# EAGLE design PalAdapter (EAGLE 7.4.0)
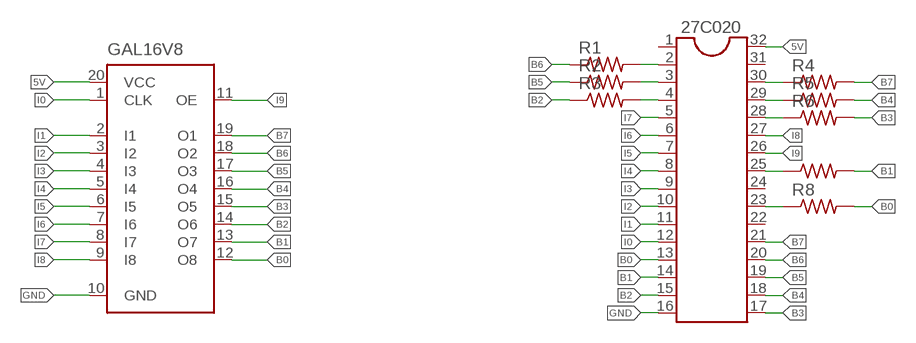
[diagram p0: schematic, sheet 1]

## Parts
27C020  DIL32  [DIL32]
GAL16V8  ATF16V8BP3  [DIL20]
R1  R-US_0204/7  [0204/7]
R2  R-US_0204/7  [0204/7]
R3  R-US_0204/7  [0204/7]
R4  R-US_0204/7  [0204/7]
R5  R-US_0204/7  [0204/7]
R6  R-US_0204/7  [0204/7]
R7  R-US_0204/7  [0204/7]
R8  R-US_0204/7  [0204/7]

## Nets
5V: 27C020.32 GAL16V8.20(VCC)
B0: 27C020.13 GAL16V8.12(O8) R8.2
B1: 27C020.14 GAL16V8.13(O7) R7.2
B2: 27C020.15 GAL16V8.14(O6) R3.1
B3: 27C020.17 GAL16V8.15(O5) R6.2
B4: 27C020.18 GAL16V8.16(O4) R5.2
B5: 27C020.19 GAL16V8.17(O3) R2.1
B6: 27C020.20 GAL16V8.18(O2) R1.1
B7: 27C020.21 GAL16V8.19(O1) R4.2
GND: 27C020.16 GAL16V8.10(GND)
I0: 27C020.12 GAL16V8.1(CLK)
I1: 27C020.11 GAL16V8.2(I1)
I2: 27C020.10 GAL16V8.3(I2)
I3: 27C020.9 GAL16V8.4(I3)
I4: 27C020.8 GAL16V8.5(I4)
I5: 27C020.7 GAL16V8.6(I5)
I6: 27C020.6 GAL16V8.7(I6)
I7: 27C020.5 GAL16V8.8(I7)
I8: 27C020.27 GAL16V8.9(I8)
I9: 27C020.26 GAL16V8.11(OE)
N$1: 27C020.2 R1.2
N$2: 27C020.3 R2.2
N$3: 27C020.4 R3.2
N$4: 27C020.30 R4.1
N$5: 27C020.29 R5.1
N$6: 27C020.28 R6.1
N$7: 27C020.25 R7.1
N$8: 27C020.23 R8.1
Unconnected: 27C020.1 27C020.22 27C020.24 27C020.31

## Library data of the parts
27C020 = ic-package:DIL32: Dual In Line
GAL16V8 = atmel:ATF16V8B: High perfomance CMOS (electrically erasable) programmable logic device (PLD) ABLE-Atmel-ABEL - P18V8R, P16V8C, P16V8AS, P17V8 COPL Atmel-WinCUPL - G16V8MS, G16V8MA, G16V8AS, G16V8 LOG/IC - GAL16V8_R, GAL16V8_G7, GAL16V8_C), GAL16V8 Tango-PLD - G16V8R, G16V8C, G16V8AS, G16V8 Source: http://www.atmel.com/dyn/resources/prod_documents/DOC0364.PDF; MPN: ATF16V8CZ-15PU; OC_FARNELL: 1551768; OC_NEWARK: 94M6254
R1-R8 = resistor:R-US_: RESISTOR, American symbol

## Board
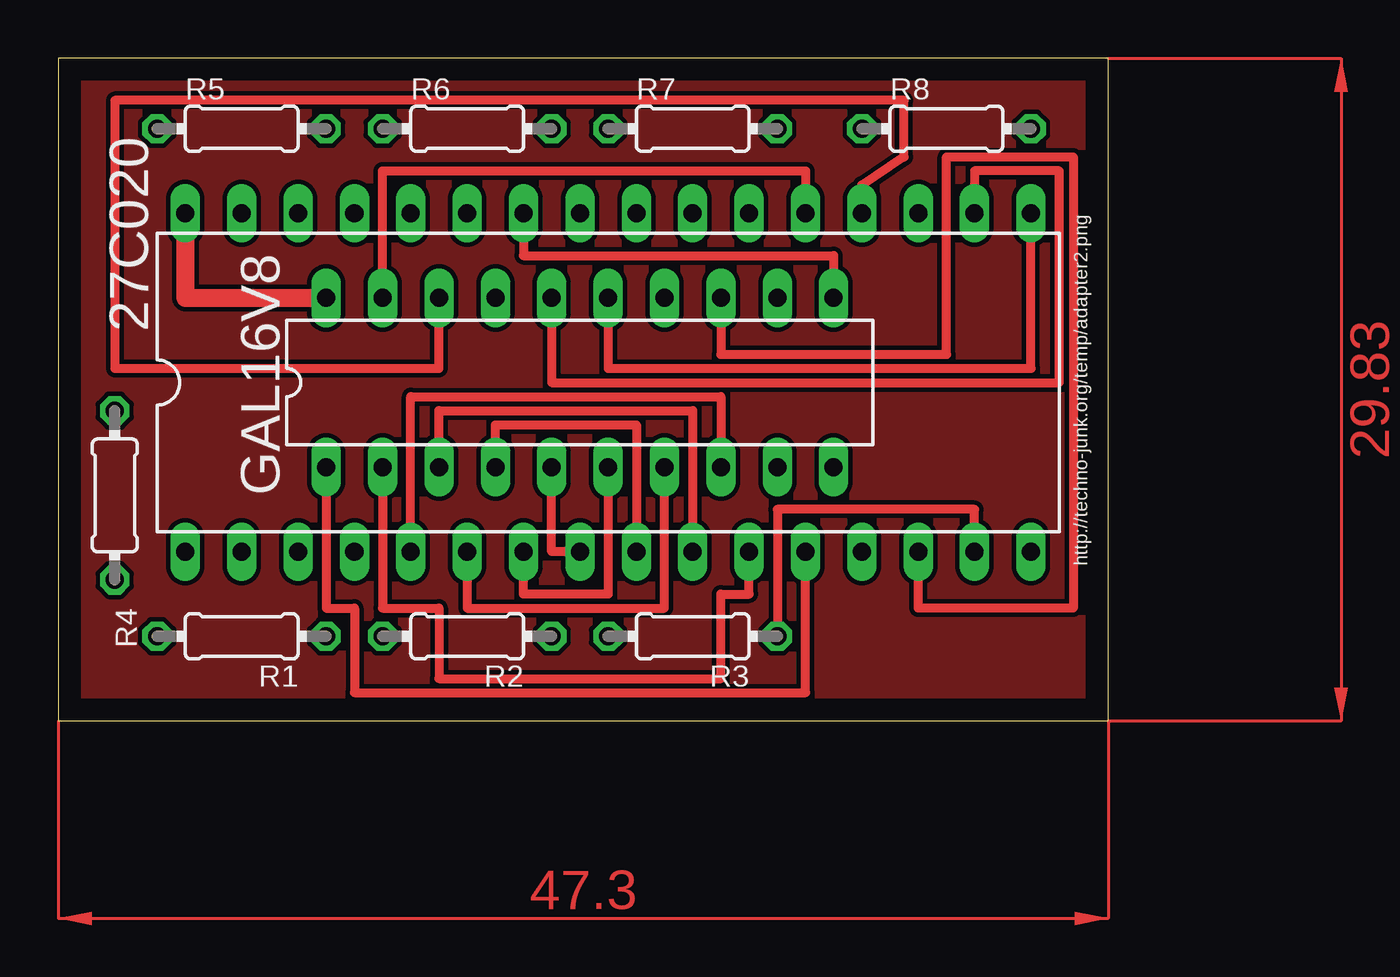
[diagram p1: board, top side]
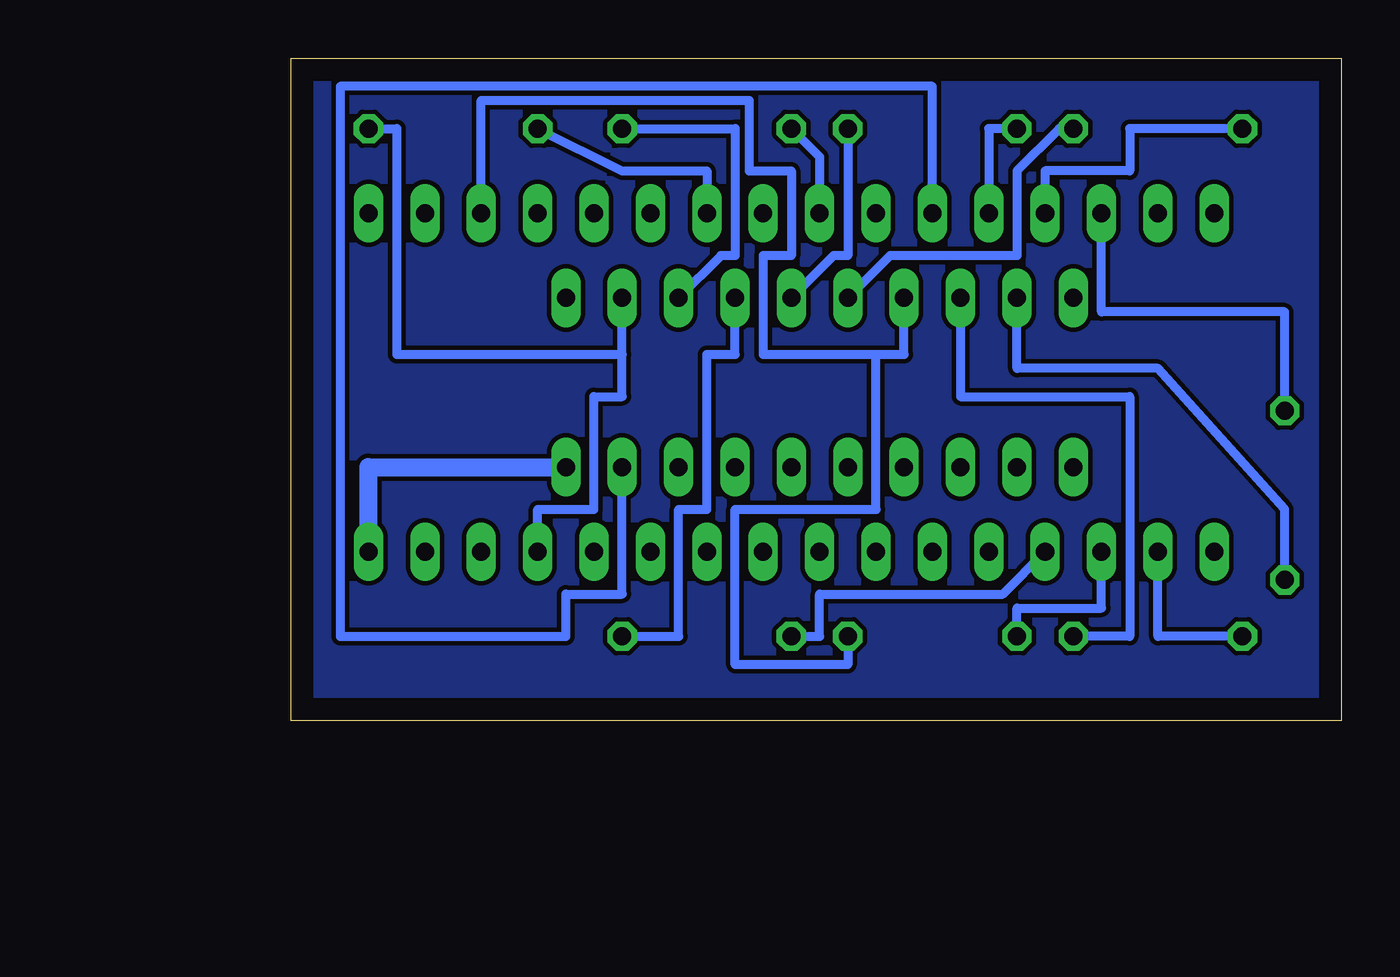
[diagram p2: board, bottom side, seen from below]

Size 47.3 x 29.83 mm. Coordinates in mm from the lower left corner, seen from the top.
Outline: 0,0 47.3,0 47.3,29.83 0,29.83 0,0
Copper layers (1*16): Top 0.035mm / dielectric 1.5mm / Bottom 0.035mm
Design rules "default": minimum track width 10mil, minimum drill 24mil, track to track 8mil, track to pad 8mil, pad to pad 8mil, via to via 8mil, smd to smd 8mil, copper to edge 40mil, drill to drill 8mil, minimum pad ring 10mil, minimum via ring 8mil, stop-mask expansion 4mil, vias tented up to drill 0mil, thermal gap 10mil

### Footprints (pad centres in the part's own frame; a part is rotated, then mirrored left to right if it is on the bottom)
DIL32 = drill 0.813 long: 1 -19.05,-7.62; 2 -16.51,-7.62; 3 -13.97,-7.62; 4 -11.43,-7.62; 5 -8.89,-7.62; 6 -6.35,-7.62; 7 -3.81,-7.62; 8 -1.27,-7.62; 9 1.27,-7.62; 10 3.81,-7.62; 11 6.35,-7.62; 12 8.89,-7.62; 13 11.43,-7.62; 14 13.97,-7.62; 15 16.51,-7.62; 16 19.05,-7.62; 17 19.05,7.62; 18 16.51,7.62; 19 13.97,7.62; 20 11.43,7.62; 21 8.89,7.62; 22 6.35,7.62; 23 3.81,7.62; 24 1.27,7.62; 25 -1.27,7.62; 26 -3.81,7.62; 27 -6.35,7.62; 28 -8.89,7.62; 29 -11.43,7.62; 30 -13.97,7.62; 31 -16.51,7.62; 32 -19.05,7.62
DIL20 = drill 0.813 long: 1 -11.43,-3.81; 2 -8.89,-3.81; 3 -6.35,-3.81; 4 -3.81,-3.81; 5 -1.27,-3.81; 6 1.27,-3.81; 7 3.81,-3.81; 8 6.35,-3.81; 9 8.89,-3.81; 10 11.43,-3.81; 11 11.43,3.81; 12 8.89,3.81; 13 6.35,3.81; 14 3.81,3.81; 15 1.27,3.81; 16 -1.27,3.81; 17 -3.81,3.81; 18 -6.35,3.81; 19 -8.89,3.81; 20 -11.43,3.81
0204/7 = drill 0.813 octagon: 1 -3.81,0; 2 3.81,0

### Placement (x,y rotation side)
27C020  24.77,15.24 0 top
GAL16V8  23.49,15.24 0 top
R1  8.25,3.81 180 top
R2  18.41,3.81 180 top
R3  28.58,3.81 180 top
R4  2.54,10.16 270 top
R5  8.25,26.67 0 top
R6  18.41,26.67 0 top
R7  28.58,26.67 0 top
R8  40.01,26.67 0 top

### Tracks (layer width: path | path; a pad name or v marks a point on that pad's centre or on a via)
5V
  Top 0.813: 27C020.32 5.71,19.05 GAL16V8.20
B0
  Bottom 0.406: R8.2 42.55,26.67 42.55,16.51 32.38,16.51 | 32.38,16.51 GAL16V8.12 | 27C020.13 36.2,9.52 33.66,9.52 33.66,14.61 32.38,14.61 32.38,16.51
B1
  Top 0.406: GAL16V8.13 29.84,16.51 40.01,16.51 40.01,25.4 45.72,25.4 45.72,5.08 38.73,5.08 27C020.14
  Bottom 0.406: R7.2 27.3,26.67 27.3,20.95 27.94,20.95 GAL16V8.13
B2
  Top 0.406: 27C020.15 41.27,9.52 32.38,9.52 R3.1
  Bottom 0.406: R3.1 29.84,3.81 29.84,9.52 28.58,9.52 28.58,16.51 27.3,16.51 GAL16V8.14
B3
  Top 0.406: GAL16V8.15 24.77,15.88 43.81,15.88 27C020.17
  Bottom 0.406: R6.2 22.23,20.95 22.86,20.95 GAL16V8.15
B4
  Top 0.406: GAL16V8.16 22.23,15.24 45.09,15.24 45.09,24.76 41.27,24.76 27C020.18
  Bottom 0.406: R5.2 12.7,26.67 14.61,24.76 14.61,20.95 20.32,20.95 GAL16V8.16
B5
  Bottom 0.406: R2.1 22.23,2.54 27.3,2.54 27.3,9.52 20.95,9.52 20.95,16.51 | 20.95,16.51 19.69,16.51 GAL16V8.17 | 27C020.19 38.73,27.94 26.67,27.94 26.67,24.76 24.77,24.76 24.77,20.95 26.03,20.95 26.03,16.51 20.95,16.51
B6
  Top 0.406: 27C020.20 36.2,24.13 38.1,25.4 38.1,27.94 2.54,27.94 2.54,15.88 17.15,15.88 GAL16V8.18
  Bottom 0.406: GAL16V8.18 17.15,14.61 9.52,14.61 9.52,3.81 R1.1
B7
  Top 0.406: GAL16V8.19 14.61,24.76 33.66,24.76 27C020.21
  Bottom 0.406: R4.2 2.54,9.52 8.25,15.88 14.61,15.88 GAL16V8.19
GND
  Bottom 0.813: 27C020.16 43.81,11.43 GAL16V8.10
I0
  Top 0.406: GAL16V8.1 12.07,5.08 13.34,5.08 13.34,1.27 33.66,1.27 27C020.12
I1
  Top 0.406: GAL16V8.2 14.61,5.08 17.15,5.08 17.15,1.91 29.84,1.91 29.84,5.72 31.12,5.72 27C020.11
I2
  Top 0.406: GAL16V8.3 17.15,13.97 28.58,13.97 27C020.10
I3
  Top 0.406: GAL16V8.4 19.69,13.33 26.03,13.33 27C020.9
I4
  Top 0.406: 27C020.8 22.23,7.62 GAL16V8.5
I5
  Top 0.406: GAL16V8.6 24.77,5.72 20.95,5.72 27C020.7
I6
  Top 0.406: 27C020.6 18.41,5.08 27.3,5.08 GAL16V8.7
I7
  Top 0.406: 27C020.5 15.88,14.61 29.84,14.61 GAL16V8.8
I8
  Bottom 0.406: 27C020.27 18.41,28.57 45.09,28.57 45.09,3.81 34.92,3.81 34.92,5.72 32.38,5.72 GAL16V8.9
I9
  Top 0.406: 27C020.26 20.95,20.95 34.92,20.95 GAL16V8.11
N$1
  Bottom 0.406: R1.2 8.25,3.81 27C020.2
N$2
  Bottom 0.406: R2.2 14.61,5.08 10.8,5.08 27C020.3
N$3
  Bottom 0.406: R3.2 23.49,3.81 23.49,5.72 15.24,5.72 27C020.4
N$4
  Bottom 0.406: R4.1 2.54,18.41 10.8,18.41 27C020.30
N$5
  Bottom 0.406: R5.1 9.52,26.67 9.52,24.76 13.34,24.76 27C020.29
N$6
  Bottom 0.406: R6.1 15.88,26.67 27C020.28
N$7
  Bottom 0.406: R7.1 23.49,25.4 27C020.25
N$8
  Bottom 0.406: R8.1 32.38,24.76 28.58,24.76 27C020.23
N$9
  pour Top: 0,29.85 46.99,29.85 46.99,0 0,0
N$10
  pour Bottom: 0,29.85 46.99,29.85 46.99,0 0,0
(copper drawn outside any net)
  shapes: Top area x2

### Text on the board
tNames: http://techno-junk.org/temp/adapter2.png